# EAGLE design danger_danger_psu-mk-4 (EAGLE 6.5.0)
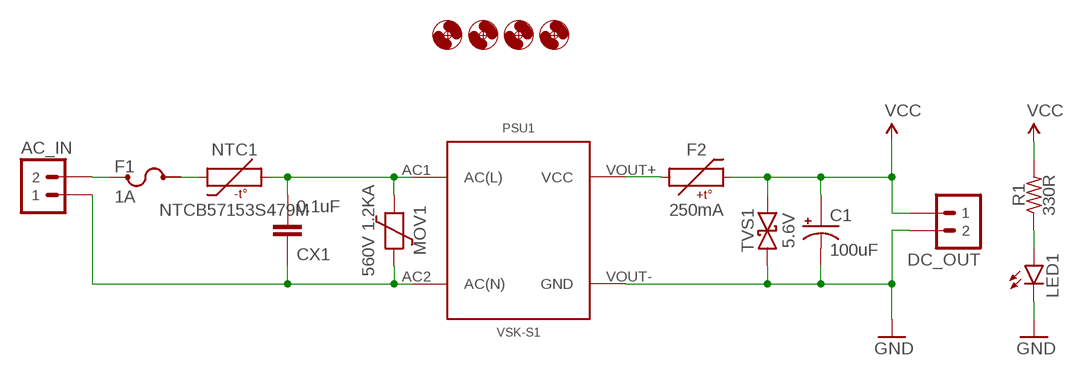
[diagram p0: schematic, sheet 1]

## Parts
AC_IN  M023.5MM  [SCREWTERMINAL-3.5MM-2]
C1  100uF  CAPACITOR-POLARIZEDE2.5-6  [E2,5-6]
CX1  0.1uF  CXXC10B6  [XC10B6]
DC_OUT  M02JST-PTH-VERT  [JST-2-PH-VERT-PTH]
F1  1A  FUSETR5  [TR5]
F2  250mA  PTCPTH-5.08MM  [PTC-PTH-5.08MM]
H1  HOLE#2  [HOLE-#2]
H2  HOLE#2  [HOLE-#2]
H3  HOLE#2  [HOLE-#2]
H4  HOLE#2  [HOLE-#2]
LED1  LED3MM  [LED3MM]
MOV1  560V 1.2KA  VARISITORVAR-5.08MM-PTH  [VAR-5.08MM-PTH]
NTC1  NTCB57153S479M  [B57153S479M]
PSU1  VSK-S1  [VSK-S1]
R1  330R  RESISTORPTH-AXIAL-5.08MM  [RESISTOR-AXIAL-PTH-5.08MM]
TVS1  5.6V  TVSDO-41-10.16MM  [DO-41-TVS-BI-10.16MM]

## Nets
GND: C1.- DC_OUT.2 LED1.K(C) PSU1.VOUT-(GND) TVS1.P$2
N$1: AC_IN.1 CX1.1 MOV1.2 PSU1.AC2(AC(N))
N$2: CX1.2 MOV1.1 NTC1.2 PSU1.AC1(AC(L))
N$3: AC_IN.2 F1.1
N$4: LED1.A R1.P$1
N$5: F1.2 NTC1.1
N$8: F2.P$1 PSU1.VOUT+(VCC)
VCC: C1.+ DC_OUT.1 F2.P$2 R1.P$2 TVS1.P$1

## Library data of the parts
AC_IN DC_OUT = A_butts:M02: Standard 2-pin 0.1" header. Use with - straight break away headers ( PRT-00116) - right angle break away headers (PRT-00553) - swiss pins (PRT-00743) - machine pins (PRT-00117) - female headers (PRT-00115) Molex polarized connector foot print use with: PRT-08233 with associated crimp pins and housings. 2.54_SCREWTERM for use with PRT-10571. 3.5mm Screw Terminal footprints for PRT-08084 5mm Screw Terminal footprints for use with PRT-08433
C1 = A_butts:CAPACITOR-POLARIZED: POLARIZED CAPACITOR, American symbol
CX1 = A_butts:CX: X CAPACITOR for power line
F1 = A_butts:FUSE
F2 = A_butts:PTC: Resettable Fuse PTC Resettable Fuse. Spark Fun Electronics SKU : COM-08357
H1-H4 = A_butts:HOLE: MOUNTING HOLE with drill center marker
LED1 = A_butts:LED: LEDs Standard schematic elements and footprints for 5mm, 3mm, 1206, and 0603 sized LEDs. 5mm - Spark Fun Electronics SKU : COM-00529 (and others)
MOV1 = A_butts:VARISITOR
NTC1 = A_butts:NTC
PSU1 = A_butts:VSK-S1: VSK-S1 is an AC/DC converter for PCB mounting.
R1 = A_butts:RESISTOR: RESISTOR, American symbol
TVS1 = A_butts:TVS: Transient voltage suppressor- prevents ESD on inputs. Ignore package description- MBRA140 is NOT this type of part!!!

## Board
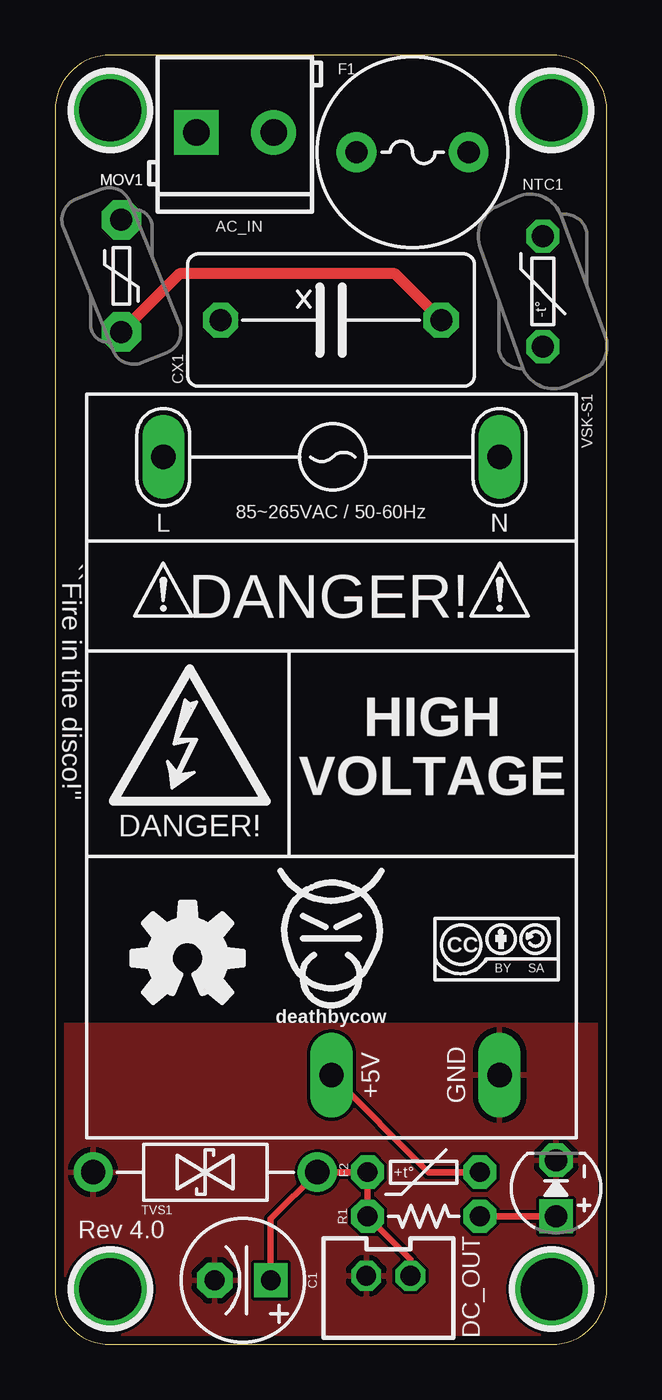
[diagram p1: board, top side]
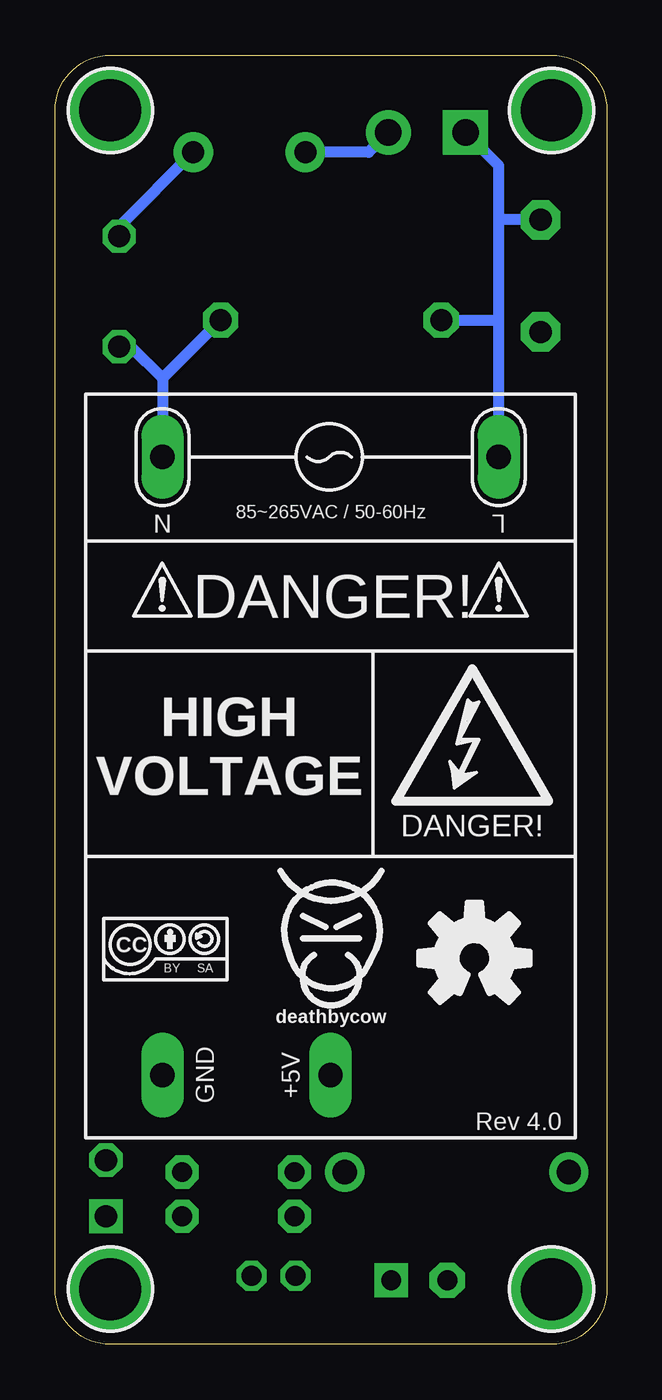
[diagram p2: board, bottom side, seen from below]

Size 25 x 58.4 mm. Coordinates in mm from the lower left corner, seen from the top.
Outline: 0,55.9 0,2.5 arc90 2.5,0 22.5,0 arc90 25,2.5 25,55.9 arc90 22.5,58.4 2.5,58.4 arc90 0,55.9
Copper layers (1*16): Top 0.0356mm / dielectric 1.5011mm / Bottom 0.0356mm
Design rules "LaenPCBOrder_2": minimum track width 6mil, minimum drill 13mil, track to track 6mil, track to pad 6mil, pad to pad 6mil, via to via 6mil, smd to smd 6mil, copper to edge 15mil, drill to drill 6mil, minimum pad ring 7mil, minimum via ring 7mil, stop-mask expansion 3mil, vias tented up to drill 20mil, thermal gap 10mil

### Footprints (pad centres in the part's own frame; a part is rotated, then mirrored left to right if it is on the bottom)
SCREWTERMINAL-3.5MM-2 = drill 1.2 pad 2.032 square: 1 0,0 | drill 1.2 pad 2.032: 2 3.5,0
E2,5-6 = drill 0.9 pad 1.524 square: + -1.27,0 | drill 0.9 pad 1.6 octagon: - 1.27,0
XC10B6 = drill 1 pad 1.6 octagon: 1 -5,0; 2 5,0
JST-2-PH-VERT-PTH = drill 0.9 octagon: 1 -1,0; 2 1,0
TR5 = drill 1 pad 1.8: 1 -2.54,0; 2 2.54,0
PTC-PTH-5.08MM = drill 0.9 pad 1.5 octagon: P$1 -2.54,0; P$2 2.54,0
HOLE-#2 = drill 2.8 pad 3.81: P$1 0,0
LED3MM = drill 1 pad 1.524 square: A -1.27,0 | drill 1 pad 1.524 octagon: K 1.27,0
VAR-5.08MM-PTH = drill 1 pad 1.778 octagon: 1 -2.54,0; 2 2.54,0
B57153S479M = drill 1 pad 1.5 octagon: 1 -2.5,0; 2 2.5,0
VSK-S1 = drill 1.1 pad 1.9 long: AC1 0,15.24; AC2 0,0 | drill 1.1 pad 1.93 long: VOUT+ 28,7.62; VOUT- 28,15.24
RESISTOR-AXIAL-PTH-5.08MM = drill 0.9 pad 1.5 octagon: P$1 -2.54,0; P$2 2.54,0
DO-41-TVS-BI-10.16MM = drill 1.1 pad 1.778: P$1 -5.08,0; P$2 5.08,0

### Placement (x,y rotation side)
AC_IN  6.4,54.9 0 top
C1  8.5,2.9 180 top
CX1  12.5,46.4 0 top
DC_OUT  15.1,3.1 180 top
F1  16.2,54 0 top
F2  16.7,7.8 180 top
H1  2.5,2.5 180 top
H2  22.5,55.9 180 top
H3  22.5,2.5 180 top
H4  2.5,55.9 180 top
LED1  22.7,7.07 90 top
MOV1  3,48.4 90 top
NTC1  22.1,47.7 270 top
PSU1  4.9,40.2 270 top
R1  16.7,5.8 180 top
TVS1  6.8,7.8 180 top
U$1  [COW_SMALL]  12.5,18.9 0 bottom
U$3  [CC-BY-SA-4.0-NO-URL]  20,17.9 0 bottom
U$4  [OSHWLOGO_BOT_0.2]  6,17.5 0 top
U$5  [OSHWLOGO_BOT_0.2]  6,17.5 0 bottom
U$6  [COW_SMALL]  12.5,18.9 0 top
U$7  [CC-BY-SA-4.0-NO-URL]  20,17.9 0 top

### Tracks (layer width: path | path; a pad name or v marks a point on that pad's centre or on a via)
GND
  pour Top: 0,14.5 25,14.5 25,2.5 arc-90 22.5,0 2.5,0 arc-90 0,2.5
N$1
  Bottom 0.5: PSU1.AC2 4.9,46.5 | 4.9,46.5 4.9,51 | 4.9,51 4.9,53.4 AC_IN.1 | MOV1.2 4.84,50.94 4.9,51 | CX1.1 5,46.4 4.9,46.5
N$2
  Top 0.5: CX1.2 15.4,48.5 5.64,48.5 MOV1.1
  Bottom 0.5: CX1.2 20.14,43.76 | 20.14,43.76 PSU1.AC1 | NTC1.2 21.58,45.2 20.14,43.76
N$3
  Bottom 0.5: AC_IN.2 10.8,54 F1.1
N$4
  Top 0.3: R1.P$1 LED1.A
N$5
  Bottom 0.5: F1.2 22.1,50.64 NTC1.1
N$8
  Top 0.3: PSU1.VOUT+ 16.92,7.8 F2.P$1
VCC
  Top 0.3: C1.+ 9.77,5.69 TVS1.P$1 F2.P$2 R1.P$2 16.1,3.86 DC_OUT.1

### Text on the board
tPlace: ``Fire in the disco!" | Rev 4.0
bPlace: Rev 4.0